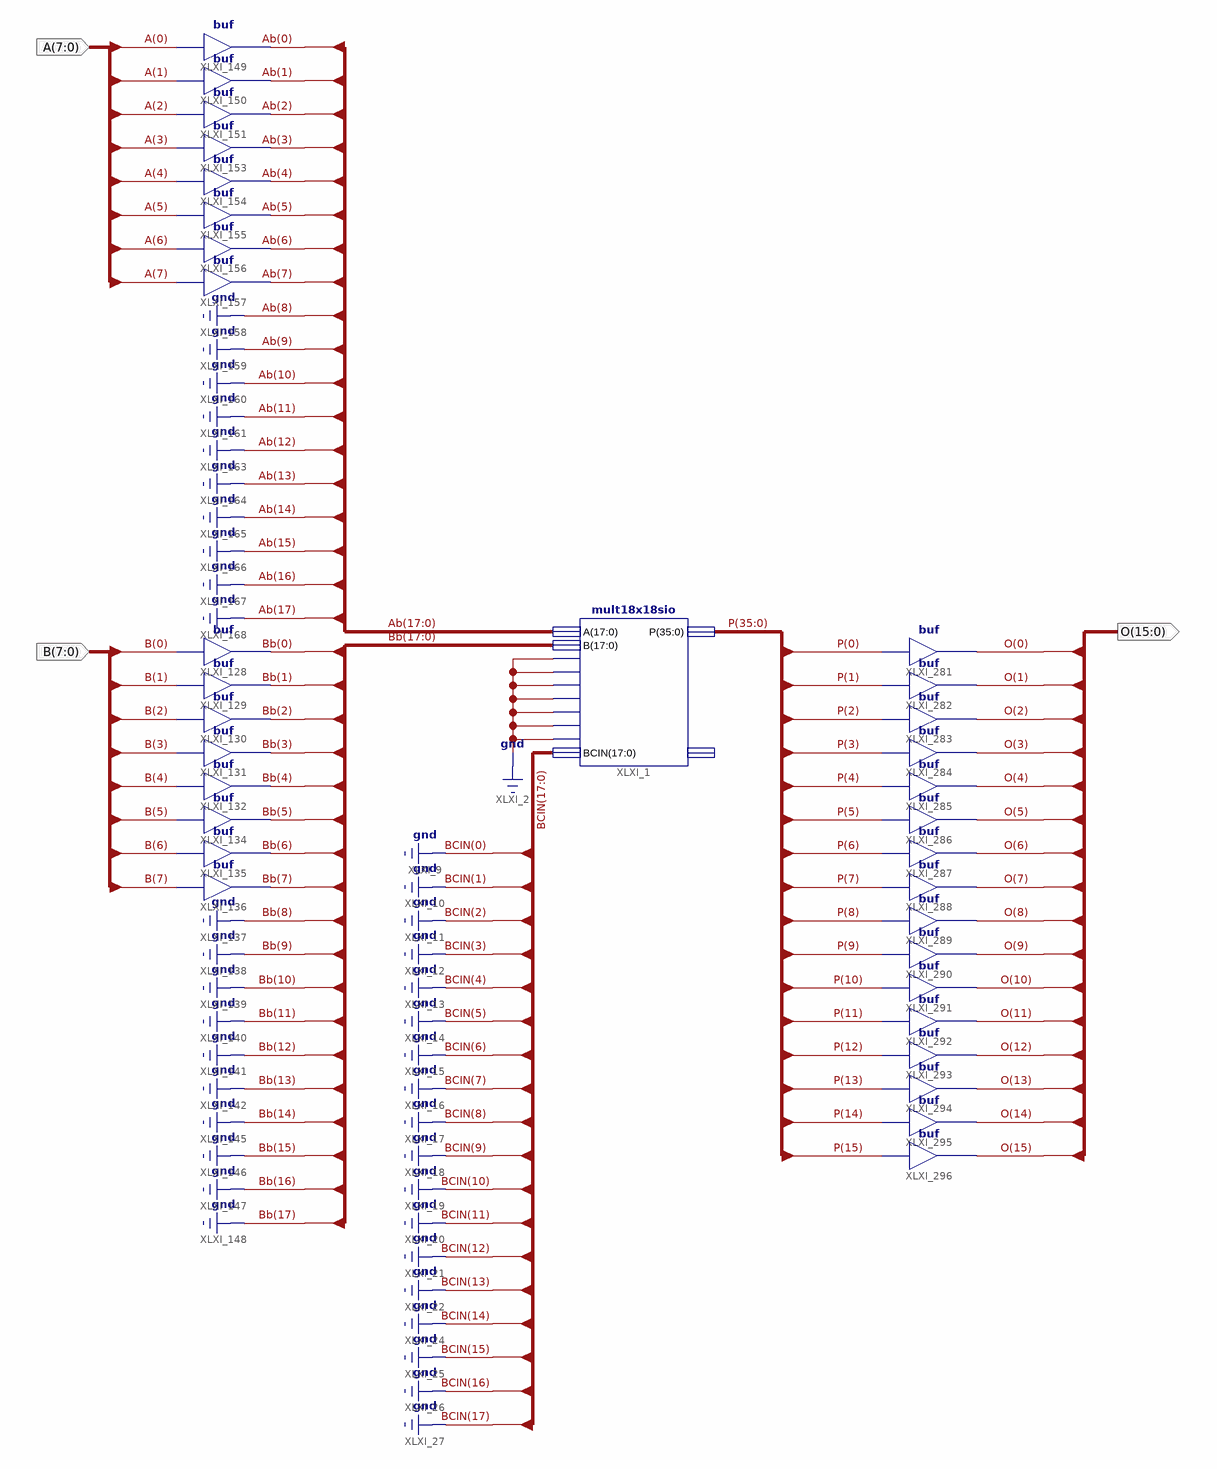
[diagram p0: schematic sheet 1]
// Xilinx ISE schematic mult8x8x16.sch (spartan6) as structural Verilog: 33 symbols, 3 ports
module mult8x8x16 (
  input  [7:0] A,
  input  [7:0] B,
  output [15:0] O
);

  wire [7:0] Ab, Bb;
  wire [35:0] P;

  buf XLXI_157 (Ab[7], A[7]);
  buf XLXI_156 (Ab[6], A[6]);
  buf XLXI_155 (Ab[5], A[5]);
  buf XLXI_154 (Ab[4], A[4]);
  buf XLXI_153 (Ab[3], A[3]);
  buf XLXI_151 (Ab[2], A[2]);
  buf XLXI_150 (Ab[1], A[1]);
  buf XLXI_149 (Ab[0], A[0]);
  buf XLXI_136 (Bb[7], B[7]);
  buf XLXI_135 (Bb[6], B[6]);
  buf XLXI_134 (Bb[5], B[5]);
  buf XLXI_132 (Bb[4], B[4]);
  buf XLXI_131 (Bb[3], B[3]);
  buf XLXI_130 (Bb[2], B[2]);
  buf XLXI_129 (Bb[1], B[1]);
  buf XLXI_128 (Bb[0], B[0]);
  mult18x18sio #(.PREG(0), .BREG(0), .AREG(0)) XLXI_1 (
    .A({{10{1'b0}}, Ab}), .B({{10{1'b0}}, Bb}), .CEA(1'b0), .CEB(1'b0), .CEP(1'b0), .CLK(1'b0), .RSTA(1'b0),
    .RSTB(1'b0), .RSTP(1'b0), .BCIN({18{1'b0}}), .P(P));  // open: BCOUT
  buf XLXI_281 (O[0], P[0]);
  buf XLXI_282 (O[1], P[1]);
  buf XLXI_283 (O[2], P[2]);
  buf XLXI_284 (O[3], P[3]);
  buf XLXI_285 (O[4], P[4]);
  buf XLXI_286 (O[5], P[5]);
  buf XLXI_287 (O[6], P[6]);
  buf XLXI_288 (O[7], P[7]);
  buf XLXI_289 (O[8], P[8]);
  buf XLXI_290 (O[9], P[9]);
  buf XLXI_291 (O[10], P[10]);
  buf XLXI_292 (O[11], P[11]);
  buf XLXI_293 (O[12], P[12]);
  buf XLXI_294 (O[13], P[13]);
  buf XLXI_295 (O[14], P[14]);
  buf XLXI_296 (O[15], P[15]);
endmodule
